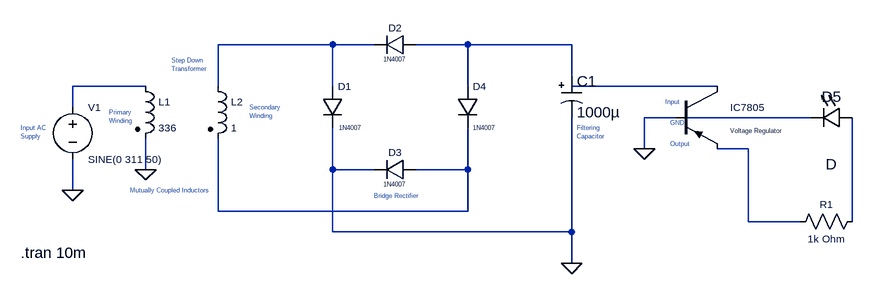
[diagram p0: schematic Physics Project.asc]
Physics Project.asc, the LTspice schematic file:
Version 4
SHEET 1 1244 680
WIRE 320 48 144 48
WIRE 384 48 320 48
WIRE 528 48 448 48
WIRE 688 48 528 48
WIRE 688 96 688 48
WIRE 32 112 -80 112
WIRE 144 112 144 48
WIRE 320 112 320 48
WIRE 528 112 528 48
WIRE 912 112 688 112
WIRE -80 144 -80 112
WIRE 848 160 800 160
WIRE 1056 160 864 160
WIRE 800 208 800 160
WIRE 960 208 912 208
WIRE 32 240 32 192
WIRE 320 240 320 176
WIRE 384 240 320 240
WIRE 528 240 528 176
WIRE 528 240 448 240
WIRE -80 272 -80 224
WIRE 144 304 144 192
WIRE 528 304 528 240
WIRE 528 304 144 304
WIRE 960 320 960 208
WIRE 1040 320 960 320
WIRE 1120 320 1120 160
WIRE 320 336 320 240
WIRE 688 336 688 160
WIRE 688 336 320 336
WIRE 688 384 688 336
FLAG 800 208 0
FLAG 32 240 0
FLAG -80 272 0
FLAG 688 384 0
SYMBOL ind2 16 96 R0
WINDOW 0 36 40 Left 1
WINDOW 3 36 80 Left 1
SYMATTR InstName L1
SYMATTR Value 336
SYMATTR Type ind
SYMBOL ind2 128 96 R0
WINDOW 0 36 40 Left 1
WINDOW 3 36 80 Left 1
SYMATTR InstName L2
SYMATTR Value 1
SYMATTR Type ind
SYMBOL diode 304 112 R0
WINDOW 0 24 0 Left 1
WINDOW 3 61 64 Right 0
SYMATTR InstName D1
SYMATTR Value 1N4007
SYMBOL diode 448 32 R90
WINDOW 0 0 32 VBottom 1
WINDOW 3 32 32 VTop 0
SYMATTR InstName D2
SYMATTR Value 1N4007
SYMBOL diode 448 224 R90
WINDOW 0 0 32 VBottom 1
WINDOW 3 32 32 VTop 0
SYMATTR InstName D3
SYMATTR Value 1N4007
SYMBOL diode 512 112 R0
WINDOW 0 24 0 Left 1
WINDOW 3 24 64 Left 0
SYMATTR InstName D4
SYMATTR Value 1N4007
SYMBOL voltage -80 128 R0
WINDOW 0 24 16 Left 1
WINDOW 3 24 96 Left 1
WINDOW 123 0 0 Left 0
WINDOW 39 0 0 Left 0
SYMATTR InstName V1
SYMATTR Value SINE(0 311 50)
SYMBOL res 1136 304 R90
WINDOW 0 0 56 VBottom 1
WINDOW 3 32 56 VTop 1
SYMATTR InstName R1
SYMATTR Value 1k Ohm
SYMBOL pnp 848 112 R0
WINDOW 0 84 32 Left 1
WINDOW 3 84 68 Left 0
SYMATTR InstName IC7805
SYMATTR Value Voltage Regulator
SYMBOL LED 1120 144 R90
WINDOW 0 0 32 VBottom 2
WINDOW 3 72 32 VTop 2
SYMATTR InstName D5
SYMBOL polcap 672 96 R0
SYMATTR InstName C1
SYMATTR Value 1000µ
TEXT 832 136 Left 0 ;Input
TEXT 840 168 Left 0 ;GND
TEXT 840 200 Left 0 ;Output
TEXT 8 272 Left 0 ;Mutually Coupled Inductors
TEXT -24 152 Left 0 ;Primary\nWinding
TEXT 192 144 Left 0 ;Secondary\nWinding
TEXT 72 72 Left 0 ;Step Down\nTransformer
TEXT 696 176 Left 0 ;Filtering \nCapacitor
TEXT 384 280 Left 0 ;Bridge Rectifier
TEXT -160 176 Left 0 ;Input AC \nSupply
TEXT -160 368 Left 2 !.tran 10m

The netlist it stands for:
* Physics Project.asc
L1 N003 0 336
L2 N001 N007 1
D1 N001 0 1N4007
D2 N002 N001 1N4007
D3 N007 0 1N4007
D4 N002 N007 1N4007
V1 N003 0 SINE(0 311 50)
R1 N008 N006 1k Ohm
Q§IC7805 N004 0 N006 0 Voltage Regulator
D5 N008 N005 D
C1 N002 0 1000µ
.model D D
.lib standard.dio
.model NPN NPN
.model PNP PNP
.lib standard.bjt
* Input
* GND
* Output
* Mutually Coupled Inductors
* Primary
* Winding
* Secondary
* Winding
* Step Down
* Transformer
* Filtering
* Capacitor
* Bridge Rectifier
* Input AC
* Supply
.tran 10m
.backanno
.end